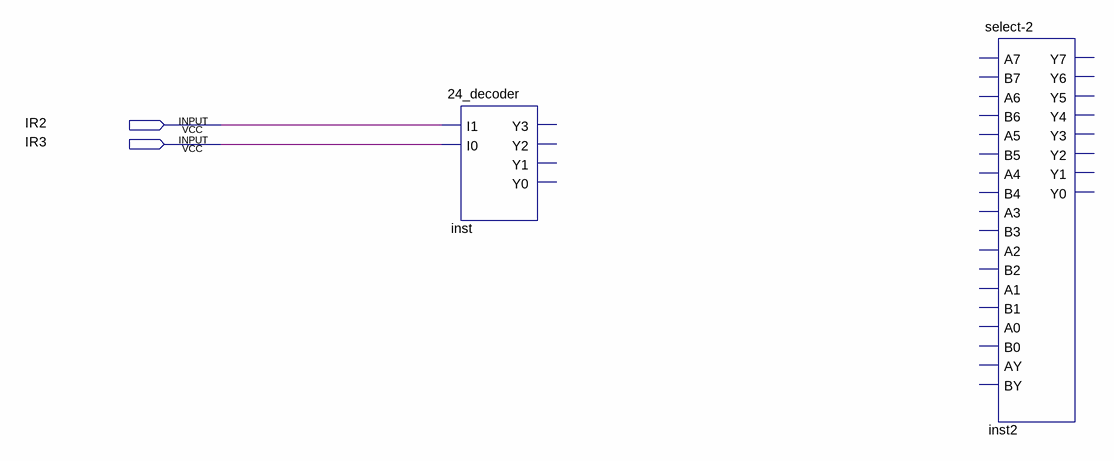
[diagram p0: schematic sheet]
// Quartus schematic Block1.bdf as structural Verilog: 2 symbols, 2 pins
module Block1 (
  input  IR2,
  input  IR3
);

  \24_decoder  inst (.I1(IR2), .I0(IR3));  // open: Y3, Y2, Y1, Y0
  \select-2  inst2 ();  // open: A7, B7, A6, B6, A5, B5, A4, B4, A3, B3, A2, B2, A1, B1, A0, B0, AY, BY, Y7, Y6, Y5, Y4, Y3, Y2, Y1, Y0
endmodule
